# EAGLE design M3 (SN755410) 1.2 (EAGLE 6.2)
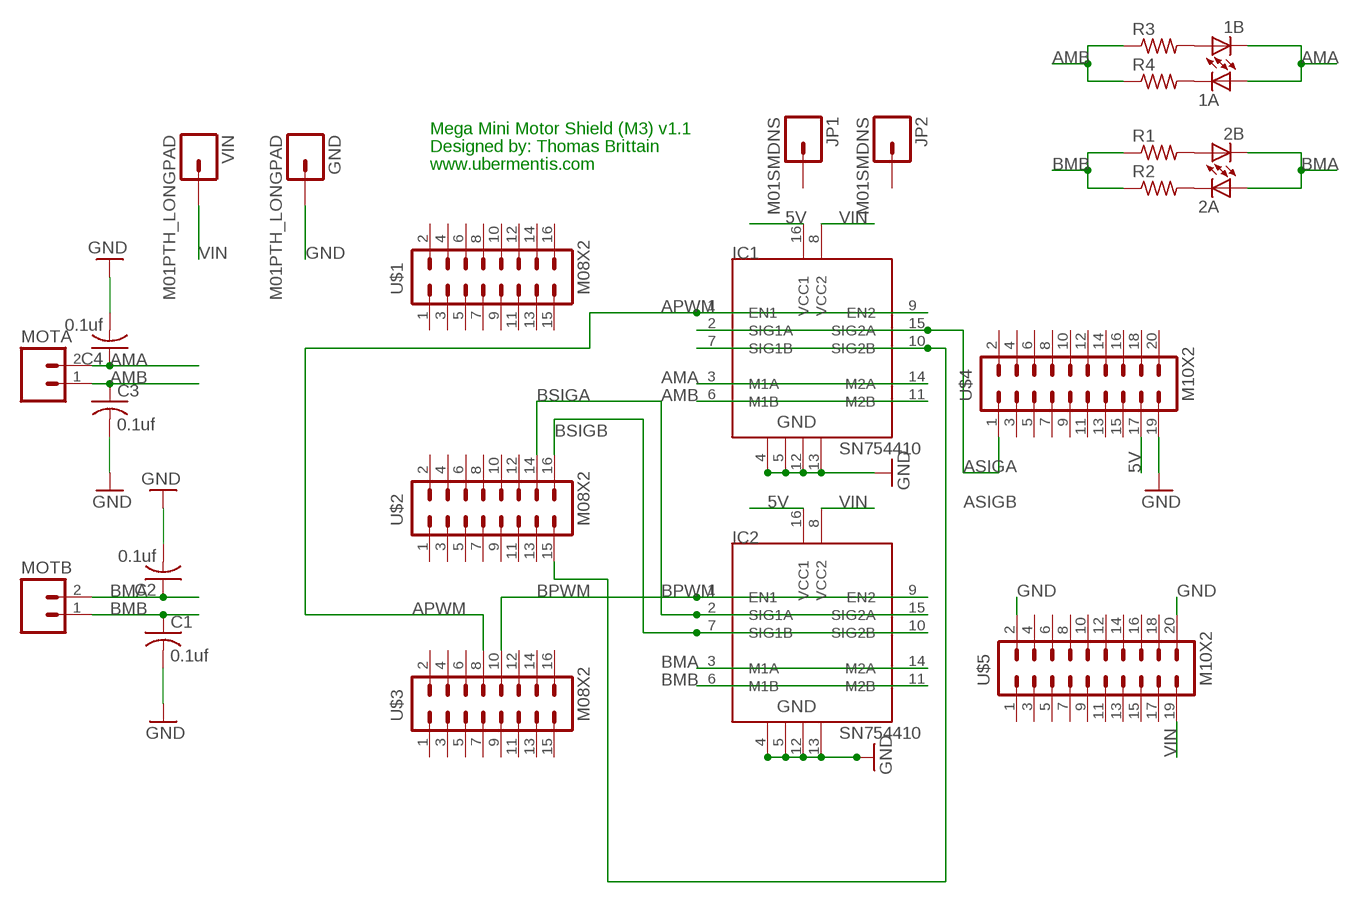
[diagram p0: schematic, sheet 1]

## Parts
1A  LEDSML0603  [SML0603]
1B  LEDSML0603  [SML0603]
2A  LEDSML0603  [SML0603]
2B  LEDSML0603  [SML0603]
C1  0.1uf  C-USC0805  [C0805]
C2  0.1uf  C-USC0805  [C0805]
C3  0.1uf  C-USC0805  [C0805]
C4  0.1uf  C-USC0805  [C0805]
GND  M01PTH_LONGPAD  [1X01_LONGPAD]
IC1  SN754410  [DIP16]
IC2  SN754410  [DIP16]
JP1  M01SMDNS  [1X01NS]
JP2  M01SMDNS  [1X01NS]
MOTA  M021X02_NO_SILK  [1X02_NO_SILK]
MOTB  M021X02_NO_SILK  [1X02_NO_SILK]
R1  R-US_R0805  [R0805]
R2  R-US_R0805  [R0805]
R3  R-US_R0805  [R0805]
R4  R-US_R0805  [R0805]
U$1  M08X2  [2X8]
U$2  M08X2  [2X8]
U$3  M08X2  [2X8]
U$4  M10X2  [2X10]
U$5  M10X2  [2X10]
VIN  M01PTH_LONGPAD  [1X01_LONGPAD]

## Nets
5V: IC1.16(VCC1) IC2.16(VCC1) U$4.17
AMA: 1A.A 1B.C C4.1 IC1.3(M1A) IC1.14(M2A) MOTA.2
AMB: C3.1 IC1.6(M1B) IC1.11(M2B) MOTA.1 R3.1 R4.1
APWM: IC1.1(EN1) IC1.9(EN2) U$3.8
ASIGA: IC1.2(SIG1A) IC1.15(SIG2A) U$4.1
ASIGB: IC1.7(SIG1B) IC1.10(SIG2B) U$2.15
BMA: 2A.A 2B.C C2.1 IC2.3(M1A) IC2.14(M2A) MOTB.2
BMB: C1.1 IC2.6(M1B) IC2.11(M2B) MOTB.1 R1.1 R2.1
BPWM: IC2.1(EN1) IC2.9(EN2) U$3.10
BSIGA: IC2.2(SIG1A) IC2.15(SIG2A) U$2.14
BSIGB: IC2.7(SIG1B) IC2.10(SIG2B) U$2.16
GND: C1.2 C2.2 C3.2 C4.2 GND.1 IC1.4 IC1.5 IC1.12 IC1.13 IC2.4 IC2.5 IC2.12 IC2.13 U$4.19 U$5.2 U$5.20
N$3: 2B.A R1.2
N$4: 2A.C R2.2
N$9: 1B.A R3.2
N$10: 1A.C R4.2
VIN: IC1.8(VCC2) IC2.8(VCC2) U$5.19 VIN.1
Unconnected: JP1.1 JP2.1 U$1.1 U$1.2 U$1.3 U$1.4 U$1.5 U$1.6 U$1.7 U$1.8 U$1.9 U$1.10 U$1.11 U$1.12 U$1.13 U$1.14 U$1.15 U$1.16 U$2.1 U$2.2 U$2.3 U$2.4 U$2.5 U$2.6 U$2.7 U$2.8 U$2.9 U$2.10 U$2.11 U$2.12 U$2.13 U$3.1 U$3.2 U$3.3 U$3.4 U$3.5 U$3.6 U$3.7 U$3.9 U$3.11 U$3.12 U$3.13 U$3.14 U$3.15 U$3.16 U$4.2 U$4.3 U$4.4 U$4.5 U$4.6 U$4.7 U$4.8 U$4.9 U$4.10 U$4.11 U$4.12 U$4.13 U$4.14 U$4.15 U$4.16 U$4.18 U$4.20 U$5.1 U$5.3 U$5.4 U$5.5 U$5.6 U$5.7 U$5.8 U$5.9 U$5.10 U$5.11 U$5.12 U$5.13 U$5.14 U$5.15 U$5.16 U$5.17 U$5.18

## Notes on the sheet
- Mega Mini Motor Shield (M3) v1.1
- Designed by: Thomas Brittain
- www.ubermentis.com

## Library data of the parts
1A 1B 2A 2B = led:LED: LED OSRAM: - CHIPLED LG R971, LG N971, LY N971, LG Q971, LY Q971, LO R971, LY R971 LH N974, LH R974 LS Q976, LO Q976, LY Q976 LO Q996 - Hyper CHIPLED LW Q18S LB Q993, LB Q99A, LB R99A - SideLED LS A670, LO A670, LY A670, LG A670, LP A670 LB A673, LV A673, LT A673, LW A673 LH A674 LY A675 LS A676, LA A676, LO A676, LY A676, LW A676 LS A679, LY A679, LG A679 - Hyper Micro SIDELED® LS Y876, LA Y876, LO Y876, LY Y876 LT Y87S - SmartLED LW L88C, LW L88S LB L89C, LB L89S, LG L890 LS L89K, LO L89K, LY L89K LS L896, LA L896, LO L896, LY L896 - TOPLED LS T670, LO T670, LY T670, LG T670, LP T670 LSG T670, LSP T670, LSY T670, LOP T670, LYG T670 LG T671, LOG T671, LSG T671 LB T673, LV T673, LT T673, LW T673 LH T674 LS T676, LA T676, LO T676, LY T676, LB T676, LH T676, LSB T676, LW T676 LB T67C, LV T67C, LT T67C, LS T67K, LO T67K, LY T67K, LW E67C LS E67B, LA E67B, LO E67B, LY E67B, LB E67C, LV E67C, LT E67C LW T67C LS T679, LY T679, LG T679 LS T770, LO T770, LY T770, LG T770, LP T770 LB T773, LV T773, LT T773, LW T773 LH T774 LS E675, LA E675, LY E675, LS T675 LS T776, LA T776, LO T776, LY T776, LB T776 LHGB T686 LT T68C, LB T68C - Hyper Mini TOPLED® LB M676 - Mini TOPLED Santana® LG M470 LS M47K, LO M47K, LY M47K Source: http://www.osram.convergy.de LUXEON: - LUMILED® LXK2-PW12-R00, LXK2-PW12-S00, LXK2-PW14-U00, LXK2-PW14-V00 LXK2-PM12-R00, LXK2-PM12-S00, LXK2-PM14-U00 LXK2-PE12-Q00, LXK2-PE12-R00, LXK2-PE12-S00, LXK2-PE14-T00, LXK2-PE14-U00 LXK2-PB12-K00, LXK2-PB12-L00, LXK2-PB12-M00, LXK2-PB14-N00, LXK2-PB14-P00, LXK2-PB14-Q00 LXK2-PR12-L00, LXK2-PR12-M00, LXK2-PR14-Q00, LXK2-PR14-R00 LXK2-PD12-Q00, LXK2-PD12-R00, LXK2-PD12-S00 LXK2-PH12-R00, LXK2-PH12-S00 LXK2-PL12-P00, LXK2-PL12-Q00, LXK2-PL12-R00 Source: www.luxeon.com KINGBRIGHT: KA-3528ASYC Source: www.kingbright.com
C1-C4 = resistor:C-US: CAPACITOR, American symbol
GND JP1 JP2 VIN = SparkFun:M01: Header 1 Standard 1-pin 0.1" header. Use with straight break away headers (SKU : PRT-00116), right angle break away headers (PRT-00553), swiss pins (PRT-00743), machine pins (PRT-00117), and female headers (PRT-00115).
IC1 IC2 = HBridge:SN754410: Quadruple half-H driver
MOTA MOTB = SparkFun:M02: Header 2 Standard 2-pin 0.1" header. Use with straight break away headers (SKU : PRT-00116), right angle break away headers (PRT-00553), swiss pins (PRT-00743), machine pins (PRT-00117), and female headers (PRT-00115). Molex polarized connector foot print use with SKU : PRT-08233 with associated crimp pins and housings.
R1-R4 = resistor:R-US_: RESISTOR, American symbol
U$1-U$3 = SparkFun:M08X2
U$4 U$5 = SparkFun:M10X2: This was SPECIALLY designed to be used with our Graphic LCD Backpack. Be sure you want to use this! It is not only staggered on each line of header holes, but IT IS ALSO offset of the center point of the top and bottom lines by 5 mil. This causes the headers to lock into place on the "standard" footprint on the LCD screen. The extra squares on the tdocu layer are there simply to reference other pins (if you were to actually populate a longer header than ten long - this is what we do with the backpacks).

## Board
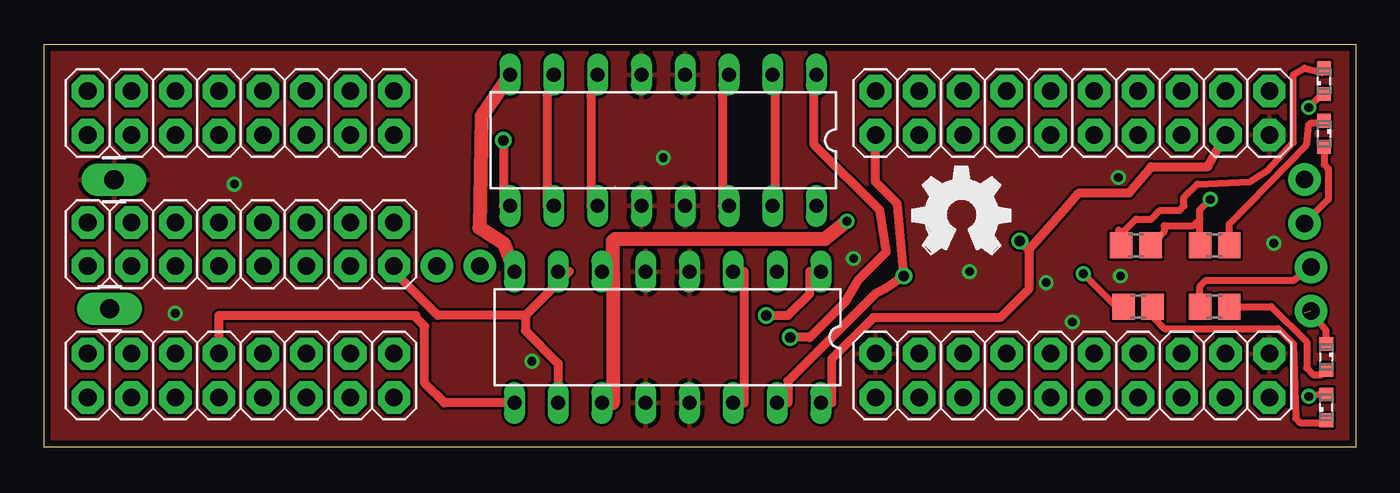
[diagram p1: board, top side]
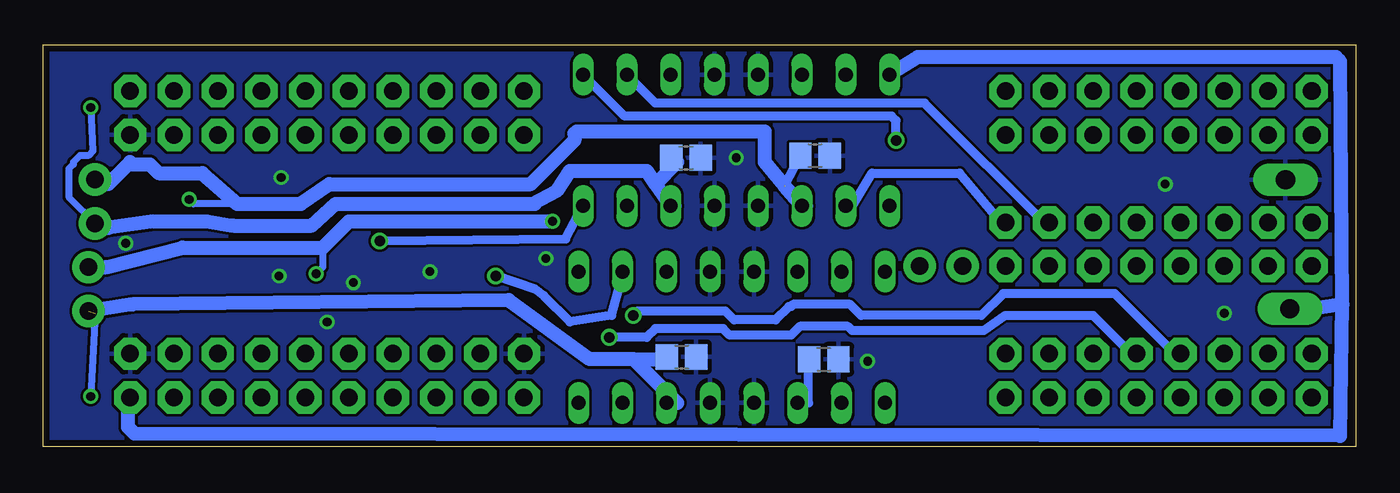
[diagram p2: board, bottom side, seen from below]

Size 76.17 x 23.32 mm. Coordinates in mm from the lower left corner, seen from the top.
Outline: 0,0 76.17,0 76.17,23.32 0,23.32 0,0
Copper layers (1*16): Top 0.0356mm / dielectric 1.5011mm / Bottom 0.0356mm
Design rules: minimum track width 6mil, minimum drill 13mil, track to track 6mil, track to pad 6mil, pad to pad 6mil, via to via 6mil, smd to smd 6mil, copper to edge 15mil, drill to drill 6mil, minimum pad ring 7mil, minimum via ring 7mil, stop-mask expansion 4mil, vias tented up to drill 0mil, thermal gap 10mil

### Footprints (pad centres in the part's own frame; a part is rotated, then mirrored left to right if it is on the bottom)
SML0603 = smd 0.8 x 0.8: A 0.75,0; C -0.75,0
C0805 = smd 1.3 x 1.5: 1 -0.85,0; 2 0.85,0
1X01_LONGPAD = drill 1.118 pad 1.88 long: 1 0,0
DIP16 = drill 0.813 long: 1 -10.16,-3.81; 2 -7.62,-3.81; 3 -5.08,-3.81; 4 -2.54,-3.81; 5 0,-3.81; 6 2.54,-3.81; 7 5.08,-3.81; 8 7.62,-3.81; 9 7.62,3.81; 10 5.08,3.81; 11 2.54,3.81; 12 0,3.81; 13 -2.54,3.81; 14 -5.08,3.81; 15 -7.62,3.81; 16 -10.16,3.81
1X01NS = drill 1.016 pad 1.88: 1 0,0
1X02_NO_SILK = drill 1.016 pad 1.88: 1 0,0; 2 2.54,0
R0805 = smd 1.3 x 1.5: 1 -0.85,0; 2 0.85,0
2X8 = drill 1.016 pad 1.88 octagon: 1 0,0; 2 0,2.54; 3 2.54,0; 4 2.54,2.54; 5 5.08,0; 6 5.08,2.54; 7 7.62,0; 8 7.62,2.54; 9 10.16,0; 10 10.16,2.54; 11 12.7,0; 12 12.7,2.54; 13 15.24,0; 14 15.24,2.54; 15 17.78,0; 16 17.78,2.54
2X10 = drill 1.016 pad 1.88 octagon: 1 -11.43,-1.27; 2 -11.43,1.27; 3 -8.89,-1.27; 4 -8.89,1.27; 5 -6.35,-1.27; 6 -6.35,1.27; 7 -3.81,-1.27; 8 -3.81,1.27; 9 -1.27,-1.27; 10 -1.27,1.27; 11 1.27,-1.27; 12 1.27,1.27; 13 3.81,-1.27; 14 3.81,1.27; 15 6.35,-1.27; 16 6.35,1.27; 17 8.89,-1.27; 18 8.89,1.27; 19 11.43,-1.27; 20 11.43,1.27

### Placement (x,y rotation side)
1A  74.42,2.29 90 top
1B  74.42,5.21 270 top
2A  74.3,18.16 270 top
2B  74.3,21.21 90 top
C1  31.37,16.89 0 bottom
C2  38.86,16.76 0 bottom
C3  30.86,5.08 0 bottom
C4  39.12,5.21 0 bottom
GND  4.06,15.49 90 top
IC1  34.92,6.35 180 top
IC2  34.67,17.78 180 top
JP1  22.81,10.49 0 top
JP2  25.3,10.49 0 top
MOTA  73.53,10.41 270 top
MOTB  73.15,15.49 270 top
R1  63.37,11.68 180 top
R2  67.94,11.68 0 top
R3  67.94,8.13 0 top
R4  63.5,8.13 0 top
U$1  2.54,18.1 0 top
U$2  2.54,10.48 0 top
U$3  2.54,2.86 0 top
U$4  59.69,19.37 0 top
U$5  59.69,4.13 0 top
U$7  [OSHW_FILLX200_NOTEXT]  50.42,11.18 0 top
VIN  3.81,8 90 top

### Tracks (layer width: path | path; a pad name or v marks a point on that pad's centre or on a via)
5V  (via drill 0.61)
  Top 0.508: IC1.16 45.72,2.54 45.72,5.08 48.13,7.49 55.5,7.49 57.15,9.14 57.15,11.43 | v56.64,11.94 57.15,11.43 | 57.15,11.43 59.18,13.72 60.07,14.73 62.99,14.73 64.26,16.26 67.56,16.26 U$4.17
  Bottom 0.508: IC2.16 45.85,12.06 v56.64,11.94
AMA  (via drill 0.51 pad 0.25)  (1 unrouted)
  Top 0.406: 1B.C 74.42,6.73 MOTA.2 | 1A.A 74.16,3.04 v73.41,2.92
  Top 0.508: IC1.14 40.64,2.54 40.64,10.16 IC1.3
  Bottom 0.406: 73.15,7.75 v73.41,2.92
  Bottom 0.508: 39.37,2.54 IC1.14 | 40.09,5.08 C4.1
  Bottom 0.813: 41.91,5.08 44.45,5.08 49.15,8.51 70.99,8.26 MOTA.2 | 39.37,2.54 41.91,5.08 | 41.91,5.08 40.09,5.08
AMB  (via drill 0.51, 0.51 pad 0.25)
  Top 0.406: R4.1 62.23,8.13 v60.33,10.03 | R3.1 67.09,9.31 67.44,9.65 72.52,9.65 MOTA.1
  Top 0.508: 33.02,2.54 IC1.11 | 33.02,10.16 IC1.6 | 33.02,11.94 33.15,12.06
  Top 0.813: 33.02,2.54 33.02,10.16 33.02,11.94 | 33.15,12.06 45.34,12.06 v46.61,13.08
  Bottom 0.406: 59.94,11.56 59.94,10.41 v60.33,10.03
  Bottom 0.508: C3.1 31.75,5.08 31.75,2.54 IC1.11
  Bottom 0.813: MOTA.1 72.52,10.41 68.07,11.56 59.94,11.56 58.42,13.08 v46.61,13.08
APWM  (via drill 0.61)
  Top 0.508: 21.46,7.62 10.16,7.62 U$3.8 10.16,5.08 | 21.46,7.62 21.59,7.62 | v41.91,7.62 43.18,7.62 44.45,8.89 44.45,10.16 IC1.1 | IC1.9 23.24,2.54 22.1,3.68 22.1,6.99 21.46,7.62
  Bottom 0.508: U$3.8 10.16,5.08 13.97,8.89 20.45,8.89 21.72,7.62 28.7,7.62 29.34,8.26 32.64,8.26 32.77,8.13 32.89,8.13 33.66,7.37 36.07,7.37 36.58,7.87 41.66,7.87 v41.91,7.62
ASIGA  (via drill 0.61)
  Top 0.508: IC1.15 43.18,2.54 43.18,3.81 48.26,8.89 48.77,9.14 v49.91,9.91 49.53,14.1 48.26,15.37 U$4.1 48.26,17.78
  Bottom 0.508: IC1.2 42.67,9.53 43.18,7.62 45.59,7.24 47.12,8.76 47.62,9.14 v49.91,9.91
ASIGB
  Top 0.508: 27.94,7.62 30.48,10.16 IC1.7 | 27.94,7.62 22.86,7.62 20.32,10.16 U$2.15 | 27.94,7.62 27.94,6.73 29.84,4.83 IC1.10
BMA  (via drill 0.51 pad 0.25)
  Top 0.406: 2A.A 74.3,16.38 74.55,16.13 74.55,14.35 MOTB.2 | 2B.C 74.05,20.33 v73.41,19.68
  Top 0.508: IC2.14 39.37,13.97 39.37,20.32 IC2.3
  Bottom 0.406: v73.41,19.68 73.28,17.14 73.53,16.89 74.04,16.89 74.42,16.51 74.42,16.38 74.68,16.13 74.68,14.48 MOTB.2
  Bottom 0.508: 39.37,13.97 IC2.14 | 39.37,16.51 C2.1
  Bottom 0.813: IC2.14 40.64,15.24 | MOTB.2 72.39,12.7 69.72,13.08 66.67,13.08 65.15,12.83 60.58,12.83 59.18,14.1 47.75,14.1 | 40.64,15.24 39.37,16.51 | 47.62,14.1 47.75,14.1 | 47.75,14.1 46.35,14.86 45.59,16 41.15,16 40.64,15.24
BMB  (via drill 0.51 pad 0.25)  (1 unrouted)
  Top 0.406: R2.1 67.09,13.21 | 67.09,13.21 67.09,13.76 v67.69,14.35 | 67.09,13.21 66.71,12.83 65.02,12.83 65.02,12.48 R1.1
  Top 0.508: IC2.11 31.75,13.97 31.75,20.32 IC2.6
  Bottom 0.406: 64.9,14.1 67.44,14.1 v67.69,14.35
  Bottom 0.508: 31.75,13.97 IC2.11 | 45.21,18.29 45.34,18.16 | 70.99,16.38 71.12,16.51 | 33.15,15.11 C1.1 | 33.02,15.24 33.13,15.15
  Bottom 0.813: 71.12,16.51 72.39,15.24 MOTB.1 | IC2.11 33.13,15.15 34.29,16.51 34.29,18.29 45.21,18.29 | 45.34,18.16 45.34,17.78 47.88,15.24 59.56,15.24 61.21,14.1 64.9,14.1 66.93,15.88 69.47,15.88 69.98,16.38 70.99,16.38
BPWM  (via drill 0.61)
  Top 0.508: v26.67,17.78 26.67,13.97 IC2.9 | v43.31,6.35 44.45,6.35 46.48,8.38 47.24,9.65 48.9,11.3 48.51,13.72 44.7,17.53 44.7,21.46 IC2.1
  Bottom 0.508: U$3.10 12.7,5.08 15.24,7.62 20.32,7.62 21.59,6.73 29.21,6.73 29.46,6.99 32.26,6.99 32.77,6.48 36.32,6.48 36.7,6.86 40.64,6.86 41.15,6.35 v43.31,6.35 | v26.67,17.78 26.67,18.92 26.92,19.18 42.42,19.18 IC2.1
BSIGA
  Top 0.508: IC2.15 42.42,14.22 42.42,20.57 IC2.2
  Bottom 0.508: U$2.14 17.78,12.7 25.02,19.94 40.64,19.94 IC2.2
BSIGB
  Top 0.508: IC2.10 29.21,13.97 29.21,20.32 IC2.7
  Bottom 0.508: U$2.16 20.32,12.7 22.99,15.88 28.07,15.88 29.21,13.97 IC2.10
GND  (via drill 0.51, 0.51 pad 0.25)
  other vias: 46.99,10.92 11.05,15.24 7.62,7.75 28.32,4.95 58.17,9.53 35.94,16.76 62.36,15.62 59.69,7.24 71.37,11.81 62.48,9.91 53.72,10.16
  pour Top: -5.21,-9.65 -4.95,-9.91 73.03,-9.14 78.99,-9.14 79.5,27.18 79.25,27.81 -5.46,27.69
  pour Bottom: -5.33,28.07 -5.21,-9.65 79.12,-9.27 79.12,18.29 79.25,27.94 57.28,27.69 2.54,28.19
N$3
  Top 0.254: 62.36,12.57 62.74,12.57
  Top 0.406: 2B.A 74.18,21.72 73.15,21.97 72.52,21.59 72.52,17.65 70.99,16 69.98,15.37 66.93,15.24 66.17,14.48 66.17,13.97 65.91,13.72 64.77,13.72 64.26,13.21 63.37,13.21 62.74,12.57 | 62.36,12.57 62.36,11.85 R1.2
N$4
  Top 0.406: R2.2 68.8,12.91 73.28,17.53 73.41,18.67 73.53,18.8 74.18,18.8 2A.C
N$9
  Top 0.406: R3.2 71.25,8.13 73.28,6.1 73.28,4.57 73.66,4.19 74.16,4.19 1B.A
N$10
  Top 0.406: R4.2 64.35,7.53 65.02,6.86 71.63,6.86 72.52,5.97 72.64,1.65 72.9,1.4 74.28,1.4 1A.C
VIN
  Top 0.813: IC2.8 25.4,19.18 25.27,12.7 26.67,11.81 IC1.8
  Bottom 0.508: U$5.19 71.12,2.54 71.25,2.54
  Bottom 0.813: 71.25,2.92 71.25,2.54 71.25,1.14 70.87,0.76 0.89,0.64 0.76,8.26 | 0.76,8.26 0.89,22.35 1.14,22.61 25.4,22.61 IC2.8 | 0.76,8.26 2.41,8 VIN.1

### Text on the board
Top: Mega Mini Motor Shield v1.2 | Designed by: Thomas Brittain | www.ubermentis.com
_tsilk: 2B | SN754410 | 2A | 1SIGA | GND | 2SIGB | 1SIGB | 2SIGA | 5V | GND | 1SIGA | VIN | APWM | BPWM | VIN | SN754410 | 1B | 1A